# EAGLE design AQS (EAGLE 9.6.2)

## Sheet 1 of 2
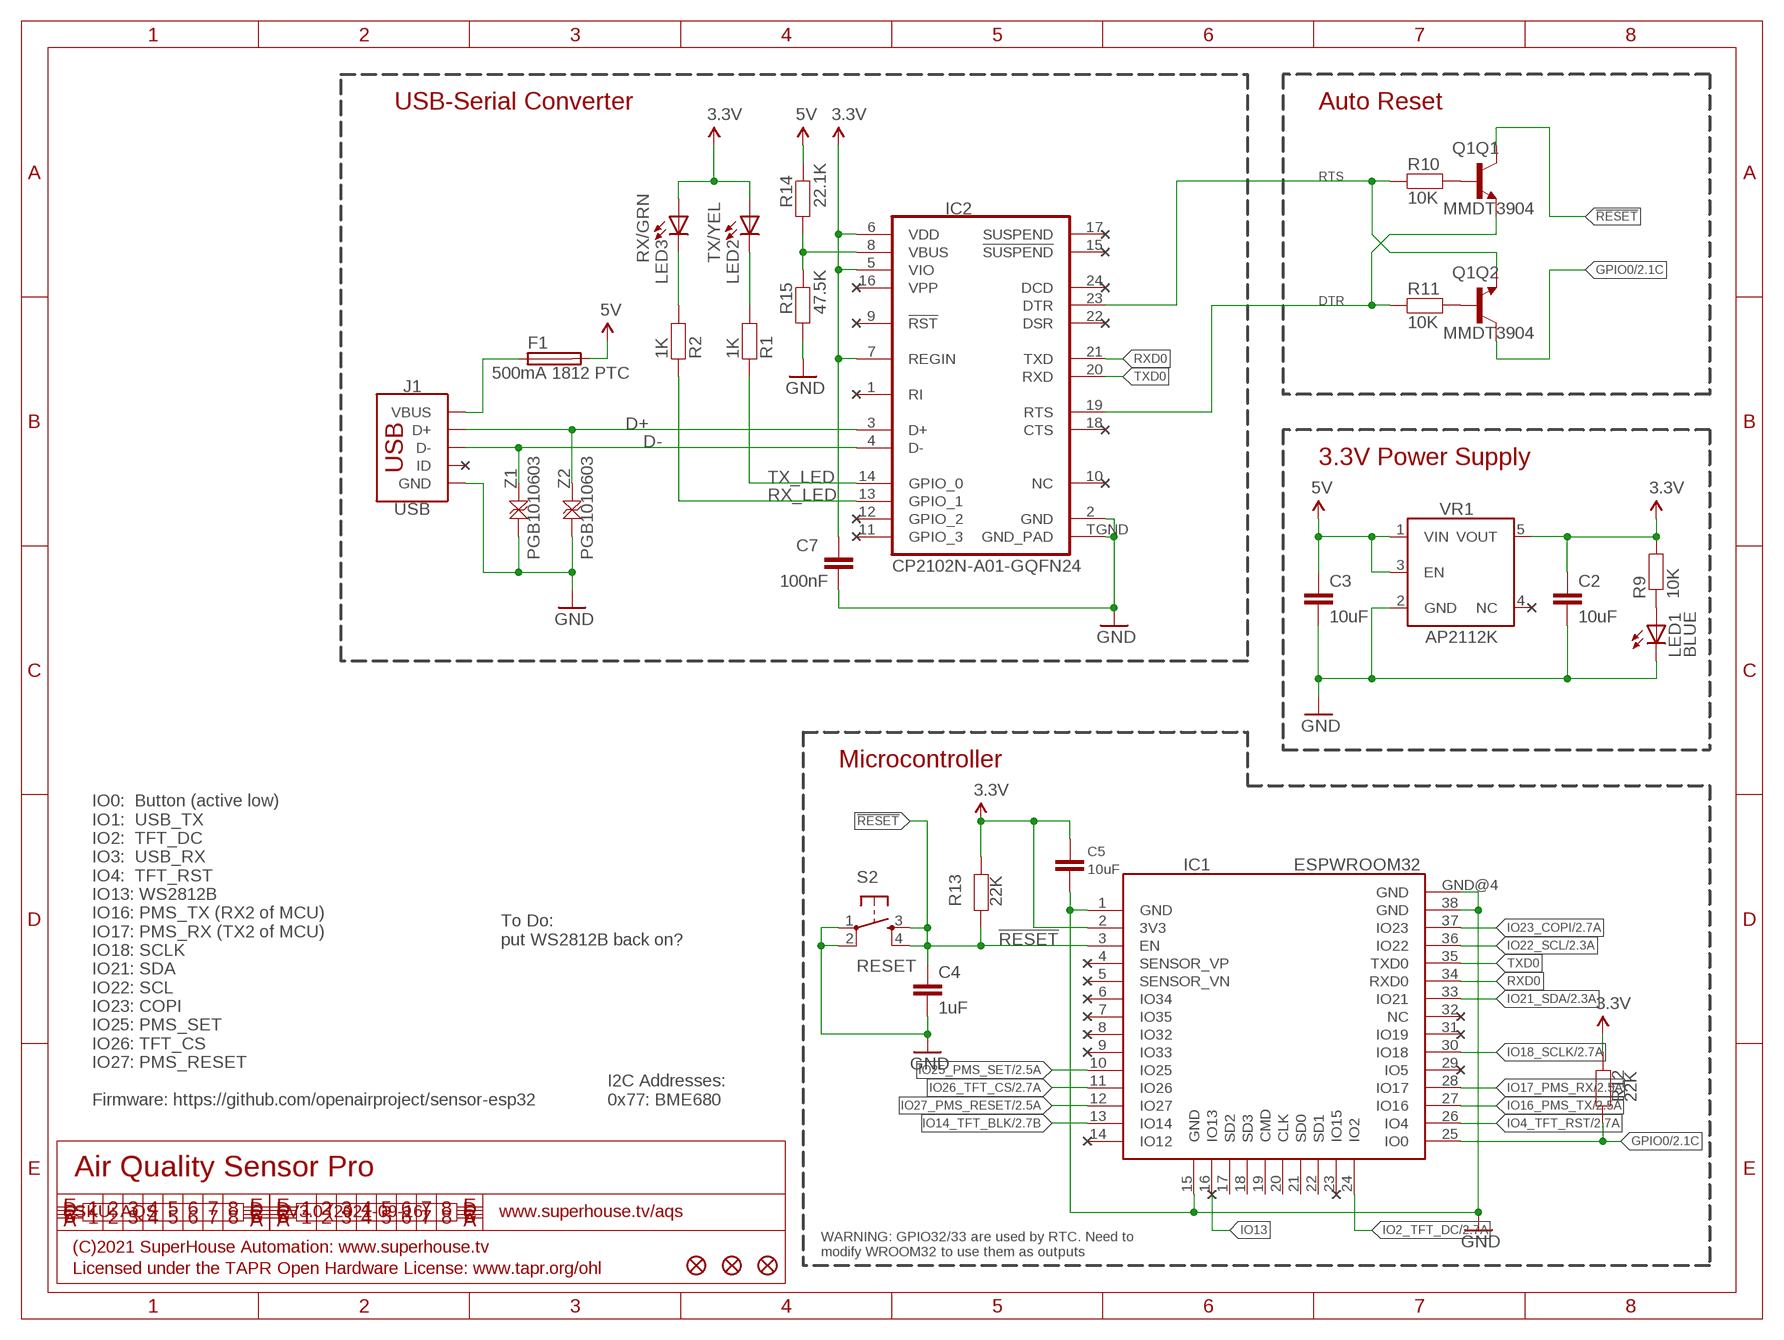
[diagram p0: schematic, sheet 1]

### Parts
C2  10uF  CAP0805  [C0805]
C3  10uF  CAP0805  [C0805]
C4  1uF  CAP0603  [C0603]
C5  10uF  CAP0805  [C0805]
C7  100nF  CAP0603  [C0603]
F1  500mA 1812 PTC  PTC-1206  [1206]
IC1  ESPWROOM32  [ESPWROOM32]
IC2  CP2102N-A01-GQFN24  CP2104  [QFN-24]
J1  USB  USB-B-5P-VERT  [USB-MICROB-VERT]
LED1  BLUE  LED0603  [LED-0603]
LED2  TX/YEL  LED0603  [LED-0603]
LED3  RX/GRN  LED0603  [LED-0603]
Q1  MMDT3904  TRANS_NPN_DUAL-MMDT3904  [SOT-363]
R1  1K  RESISTOR0603  [R0603]
R2  1K  RESISTOR0603  [R0603]
R9  10K  RESISTOR0603  [R0603]
R10  10K  RESISTOR0603  [R0603]
R11  10K  RESISTOR0603  [R0603]
R12  22K  RESISTOR0603  [R0603]
R13  22K  RESISTOR0603  [R0603]
R14  22.1K  RESISTOR0603  [R0603]
R15  47.5K  RESISTOR0603  [R0603]
S2  RESET  TAC_SWITCH-PTH-4.5  [TACTILE-PTH-4.5MM]
U$23  FIDUCIAL1X2  [FIDUCIAL-1X2]
U$24  FIDUCIAL1X2  [FIDUCIAL-1X2]
U$25  FIDUCIAL1X2  [FIDUCIAL-1X2]
VR1  AP2112KSOT25  [SOT23-5]
Z1  PGB1010603  TVS0603  [TVS0603]
Z2  PGB1010603  TVS0603  [TVS0603]

### Nets
3.3V: C2.1 C5.1 C7.1 IC1.2(3V3) IC2.5(VIO) IC2.6(VDD) IC2.7(REGIN) LED2.A LED3.A R9.2 R12.1 R13.1 VR1.5(VOUT) ; also sheet 2
5V: C3.1 F1.2 R14.2 VR1.1(VIN) VR1.3(EN) ; also sheet 2
!RESET: C4.1 IC1.3(EN) Q1.3(Q1:C) R13.2 S2.3 S2.4
D+: IC2.3(D+) J1.3(D+) Z2.2
D-: IC2.4(D-) J1.2(D-) Z1.2
DTR: IC2.23(DTR) Q1.1(Q2:E) R10.1
GND: C2.2 C3.2 C4.2 C5.2 C7.2 IC1.1(GND) IC1.15(GND) IC1.38(GND) IC1.GND@4(GND) IC2.2(GND) IC2.TGND(GND_PAD) J1.5(GND) J1.POST1(GND) J1.POST2(GND) LED1.C R15.1 S2.1 S2.2 VR1.2(GND) Z1.1 Z2.1 ; also sheet 2
GPIO0: IC1.25(IO0) Q1.6(Q2:C) R12.2 ; also sheet 2
IO2_TFT_DC: IC1.24(IO2) ; also sheet 2
IO4_TFT_RST: IC1.26(IO4) ; also sheet 2
IO13: IC1.16(IO13)
IO14_TFT_BLK: IC1.13(IO14) ; also sheet 2
IO16_PMS_TX: IC1.27(IO16) ; also sheet 2
IO17_PMS_RX: IC1.28(IO17) ; also sheet 2
IO18_SCLK: IC1.30(IO18) ; also sheet 2
IO21_SDA: IC1.33(IO21) ; also sheet 2
IO22_SCL: IC1.36(IO22) ; also sheet 2
IO23_COPI: IC1.37(IO23) ; also sheet 2
IO25_PMS_SET: IC1.10(IO25) ; also sheet 2
IO26_TFT_CS: IC1.11(IO26) ; also sheet 2
IO27_PMS_RESET: IC1.12(IO27) ; also sheet 2
N$1: LED1.A R9.1
N$2: LED3.C R2.2
N$3: F1.1 J1.1(VBUS)
N$7: Q1.5(Q1:B) R10.2
N$8: Q1.2(Q2:B) R11.2
N$13: LED2.C R1.2
N$39: IC2.8(VBUS) R14.1 R15.2
RTS: IC2.19(RTS) Q1.4(Q1:E) R11.1
RX_LED: IC2.13(GPIO_1) R2.1
RXD0: IC1.34(RXD0) IC2.21(TXD)
TX_LED: IC2.14(GPIO_0) R1.1
TXD0: IC1.35(TXD0) IC2.20(RXD)
Unconnected: IC1.4(SENSOR_VP) IC1.5(SENSOR_VN) IC1.6(IO34) IC1.7(IO35) IC1.8(IO32) IC1.9(IO33) IC1.14(IO12) IC1.17(SD2) IC1.18(SD3) IC1.19(CMD) IC1.20(CLK) IC1.21(SD0) IC1.22(SD1) IC1.23(IO15) IC1.29(IO5) IC1.31(IO19) IC1.32(NC) IC2.1(RI) IC2.9(!RST) IC2.10(NC) IC2.11(GPIO_3) IC2.12(GPIO_2) IC2.15(!SUSPEND) IC2.16(VPP) IC2.17(SUSPEND) IC2.18(CTS) IC2.22(DSR) IC2.24(DCD) J1.4(ID) VR1.4(NC)

### Notes on the sheet
- USB-Serial Converter | Auto Reset
- 3.3V Power Supply
- Microcontroller
- To Do:
  put WS2812B back on?
- IO0:  Button (active low)
  IO1:  USB_TX
  IO2:  TFT_DC
  IO3:  USB_RX
  IO4:  TFT_RST
  IO13: WS2812B
  IO16: PMS_TX (RX2 of MCU)
  IO17: PMS_RX (TX2 of MCU)
  IO18: SCLK
  IO21: SDA
  IO22: SCL
  IO23: COPI
  IO25: PMS_SET
  IO26: TFT_CS
  IO27: PMS_RESET
  
  Firmware: https://github.com/openairproject/sensor-esp32
- I2C Addresses:
  0x77: BME680
- Air Quality Sensor Pro
- SKU: AQS | V3.0 (2021-09-16) | www.superhouse.tv/aqs
- (C)2021 SuperHouse Automation: www.superhouse.tv
- WARNING: GPIO32/33 are used by RTC. Need to
  modify WROOM32 to use them as outputs
- Licensed under the TAPR Open Hardware License: www.tapr.org/ohl

## Sheet 2 of 2
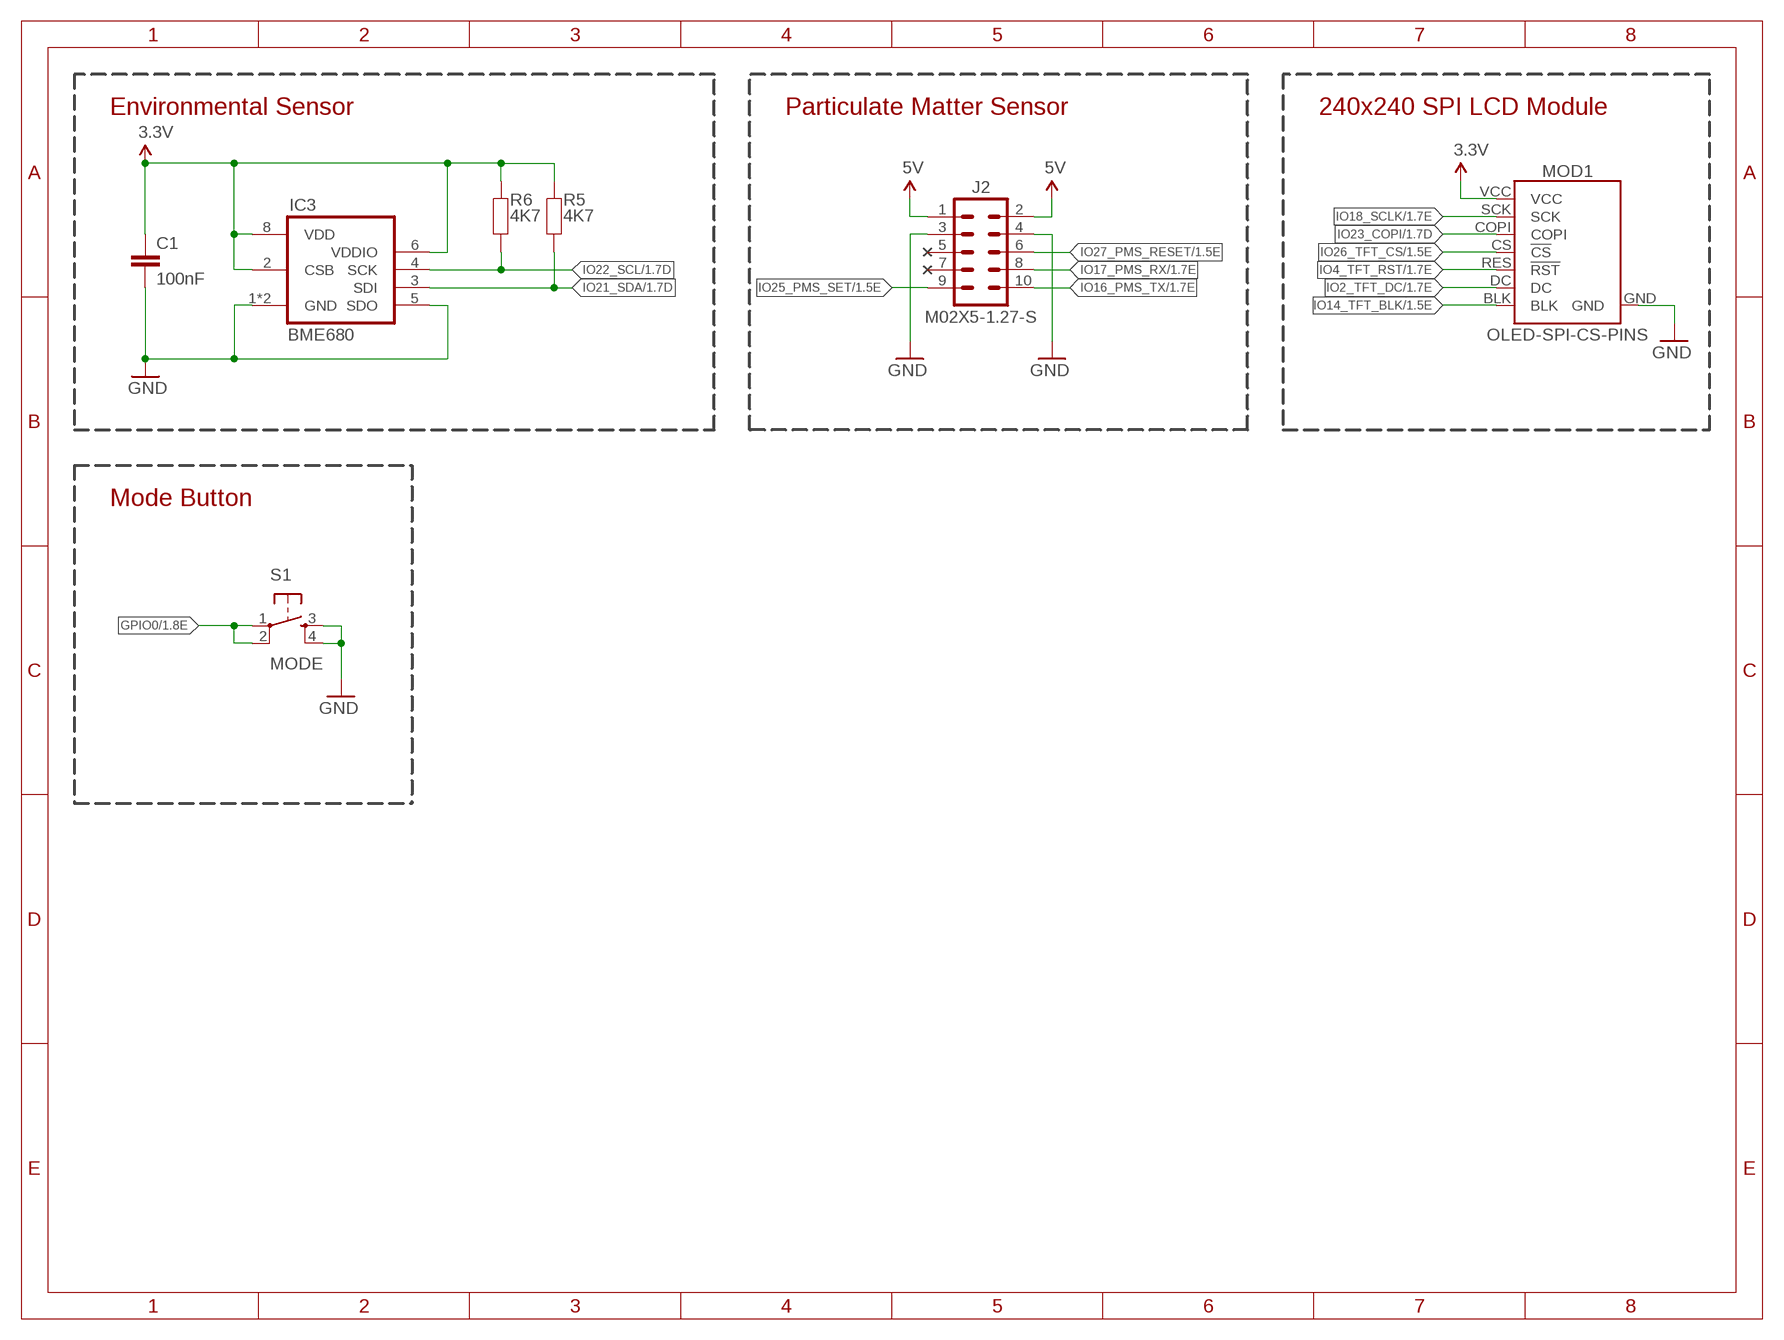
[diagram p1: schematic, sheet 2]

### Parts
C1  100nF  CAP0603  [C0603]
IC3  BME680  [BME680]
J2  M02X5-1.27-S  [2X05-1.27-S]
MOD1  OLED-SPI-CS-PINS  [OLED-240X240-1.54]
R5  4K7  RESISTOR0603  [R0603]
R6  4K7  RESISTOR0603  [R0603]
S1  MODE  TAC_SWITCH-PTH-4.5  [TACTILE-PTH-4.5MM]

### Nets
3.3V: C1.1 IC3.2(CSB) IC3.6(VDDIO) IC3.8(VDD) MOD1.VCC R5.2 R6.2 ; also sheet 1
5V: J2.1 J2.2 ; also sheet 1
GND: C1.2 IC3.1(GND) IC3.5(SDO) IC3.7(GND) J2.3 J2.4 MOD1.GND S1.3 S1.4 ; also sheet 1
GPIO0: S1.1 S1.2 ; also sheet 1
IO2_TFT_DC: MOD1.DC ; also sheet 1
IO4_TFT_RST: MOD1.RES(!RST) ; also sheet 1
IO14_TFT_BLK: MOD1.BLK ; also sheet 1
IO16_PMS_TX: J2.10 ; also sheet 1
IO17_PMS_RX: J2.8 ; also sheet 1
IO18_SCLK: MOD1.SCK ; also sheet 1
IO21_SDA: IC3.3(SDI) R5.1 ; also sheet 1
IO22_SCL: IC3.4(SCK) R6.1 ; also sheet 1
IO23_COPI: MOD1.COPI ; also sheet 1
IO25_PMS_SET: J2.9 ; also sheet 1
IO26_TFT_CS: MOD1.CS(!CS) ; also sheet 1
IO27_PMS_RESET: J2.6 ; also sheet 1
Unconnected: J2.5 J2.7

### Notes on the sheet
- Environmental Sensor | Particulate Matter Sensor | 240x240 SPI LCD Module
- Mode Button

## Library data of the parts
C1-C5 C7 = SuperHouse-DiscreteSemi:CAP: Capacitor Standard ceramic capacitor
F1 = SuperHouse-Fuses:PTC: Resettable polyfuses
IC1 = SuperHouse-MCUs:ESPWROOM32: Espressif WROOM32 ESP32 module
IC2 = SuperHouse-ICs:CP2104: CP2104 / CP2102N-A01-GQFN24 CP2104 USB to serial converter. The CP2104 is not recommended for new designs: replace with CP2102N-A01-GQFN24.
IC3 = SuperHouse-Sensors:BME680: BME680 humdity, pressure, temperature, and gas sensor
J1 = SuperHouse-Connectors:USB-B-5P: USB connector with 5 pins
J2 = SuperHouse-Connectors:M02X5: M10 header in 2x5 format
LED1-LED3 = SuperHouse-LEDs:LED: LEDs in various sizes including 5mm and 3mm PTH, and 0402, 0603, 0805, etc SMT
MOD1 = SuperHouse-Displays:OLED-SPI-CS
Q1 = SuperHouse-DiscreteSemi:TRANS_NPN_DUAL: MMDT3904 Dual 3904 NPN transistors. Datasheet <http://www.onsemi.com/pub_link/Collateral/MBT3904DW1T1-D.PDF>; PROD_ID: TRANS-13337
R1 R2 R5 R6 R9-R15 = SuperHouse-DiscreteSemi:RESISTOR: Resistor Standard resistors.
S1 S2 = SuperHouse-Switches:TAC_SWITCH: Momentary Switch Tactile switch, normally-open.
U$23-U$25 = SuperHouse-Symbols:FIDUCIAL: Fiducial Alignment Points Various fiducial points for machine vision alignment.
VR1 = SuperHouse-Regulators:AP2112K: AP2112K LDO linear voltage regulator
Z1 Z2 = SuperHouse-DiscreteSemi:TVS: TVS voltage protection Zener

## Net classes
0 default: width 0.203 mm, drill 0.356 mm, clearance 0.152 mm
1 power: width 0.203 mm, clearance 0.152 mm

## Board
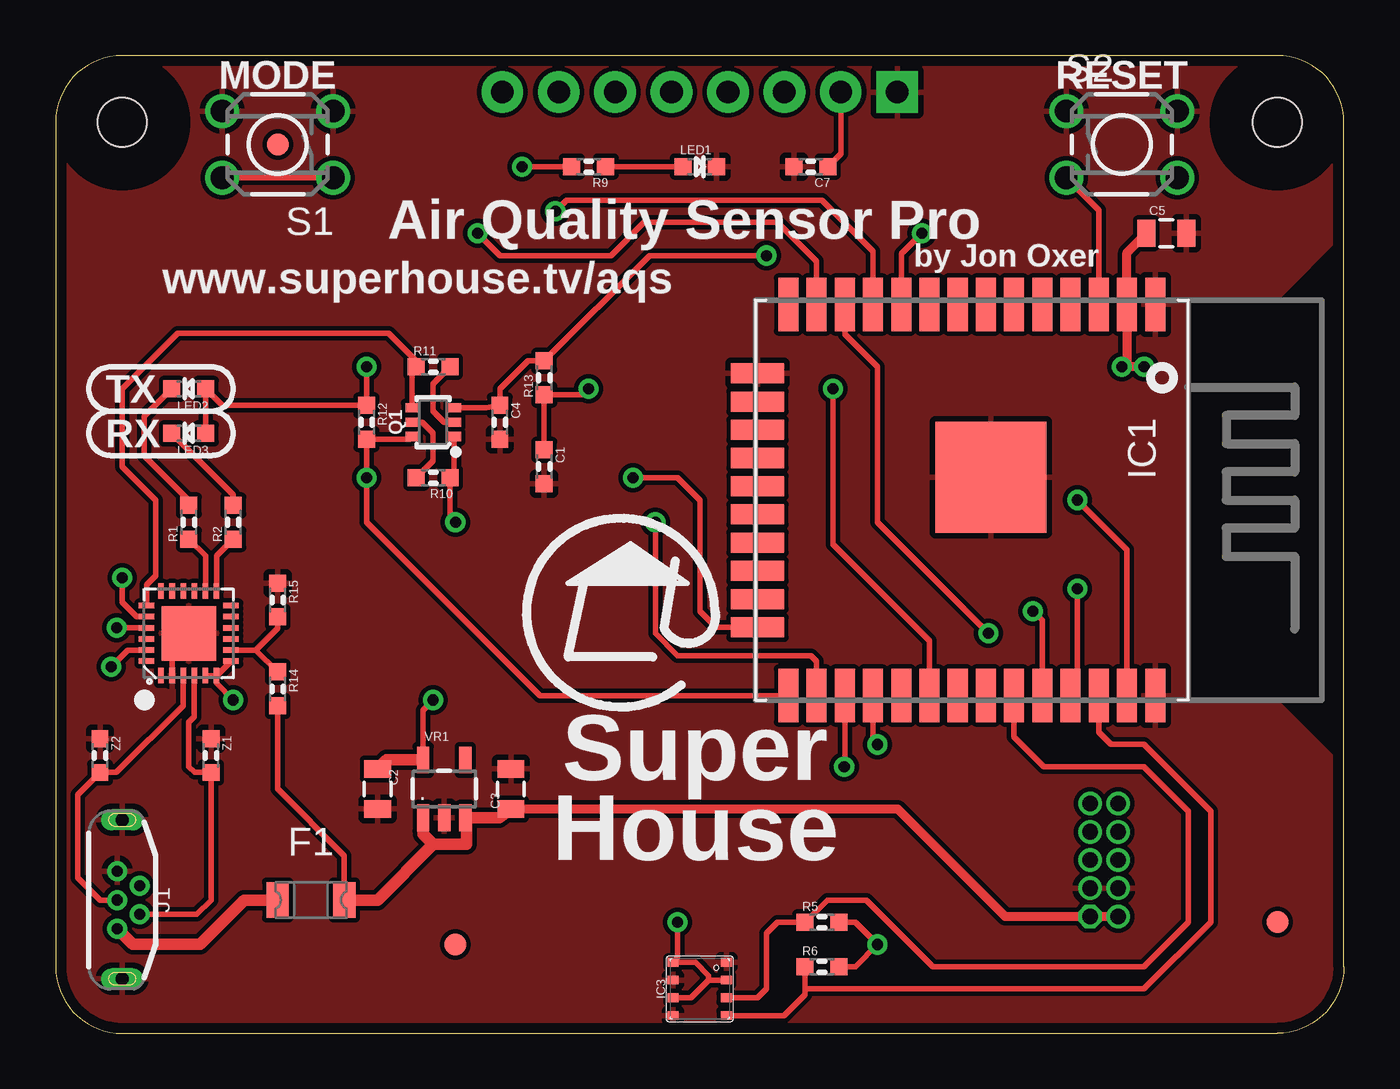
[diagram p2: board, top side]
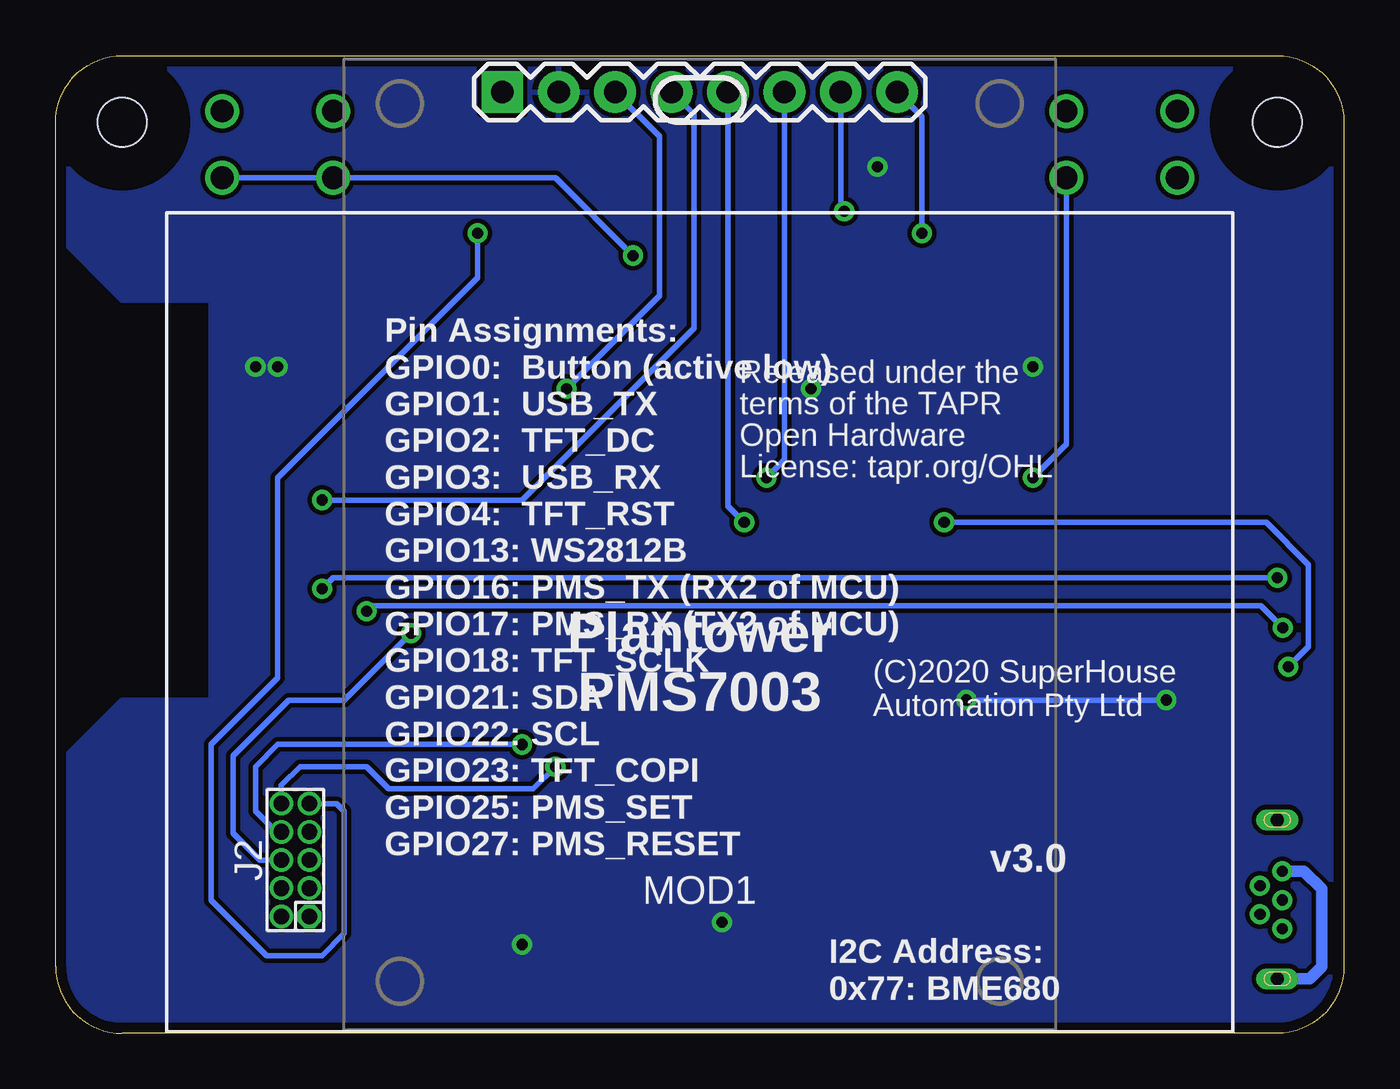
[diagram p3: board, bottom side, seen from below]

Size 58 x 44 mm. Coordinates in mm from the lower left corner, seen from the top.
Outline: 0,41 0,3 arc90 3,0 55,0 arc90 58,3 58,41 arc90 55,44 3,44 arc90 0,41
Copper layers (1*16): Top 0.035mm / dielectric 1.5mm / Bottom 0.035mm
Design rules "SuperHouse-Design-Rules *": minimum track width 10mil, minimum drill 24mil, track to track 8mil, track to pad 8mil, pad to pad 8mil, via to via 8mil, smd to smd 6mil, copper to edge 18mil, drill to drill 8mil, minimum pad ring 7mil, minimum via ring 8mil, stop-mask expansion 4mil, vias tented up to drill 0.5mm, thermal gap 10mil
Holes 2.2 mm at 3,41 55,41
tRestrict: area 0,38 to 6,44; area 52,38 to 58,44
bRestrict: area 0,38 to 6,44; area 52,38 to 58,44

### Footprints (pad centres in the part's own frame; a part is rotated, then mirrored left to right if it is on the bottom)
C0603 = smd 0.762 x 0.762: 1 -0.762,0; 2 0.762,0
C0805 = smd 0.8 x 1.2: 1 -0.9,0; 2 0.9,0
1206 = smd 1 x 1.6: 1 -1.5,0; 2 1.5,0
ESPWROOM32 = smd 2.4 x 0.9: 1 -8.8,-1.5; 2 -8.8,-2.77; 3 -8.8,-4.04; 4 -8.8,-5.31; 5 -8.8,-6.58; 6 -8.8,-7.85; 7 -8.8,-9.12; 8 -8.8,-10.39; 9 -8.8,-11.66; 10 -8.8,-12.93; 11 -8.8,-14.2; 12 -8.8,-15.47; 13 -8.8,-16.74; 14 -8.8,-18.01; 25 8.8,-18.01; 26 8.8,-16.74; 27 8.8,-15.47; 28 8.8,-14.2; 29 8.8,-12.93; 30 8.8,-11.66; 31 8.8,-10.39; 32 8.8,-9.12; 33 8.8,-7.85; 34 8.8,-6.58; 35 8.8,-5.31; 36 8.8,-4.04; 37 8.8,-2.77; 38 8.8,-1.5 | smd 0.9 x 2.4: 15 -5.7,-19.4; 16 -4.43,-19.4; 17 -3.16,-19.4; 18 -1.89,-19.4; 19 -0.62,-19.4; 20 0.65,-19.4; 21 1.92,-19.4; 22 3.19,-19.4; 23 4.46,-19.4; 24 5.73,-19.4 | smd 5 x 5: GND@4 -1.03,-8.89
QFN-24 = smd 0.25 x 0.7: 1 -1.25,-1.9; 2 -0.75,-1.9; 3 -0.25,-1.9; 4 0.25,-1.9; 5 0.75,-1.9; 6 1.25,-1.9; 13 1.25,1.9; 14 0.75,1.9; 15 0.25,1.9; 16 -0.25,1.9; 17 -0.75,1.9; 18 -1.25,1.9 | smd 0.7 x 0.25: 7 1.9,-1.25; 8 1.9,-0.75; 9 1.9,-0.25; 10 1.9,0.25; 11 1.9,0.75; 12 1.9,1.25; 19 -1.9,1.25; 20 -1.9,0.75; 21 -1.9,0.25; 22 -1.9,-0.25; 23 -1.9,-0.75; 24 -1.9,-1.25 | smd 2.45 x 2.45: TGND 0,0
BME680 = smd 0.4 x 0.5: 1 1.2,-1.2; 2 0.4,-1.2; 3 -0.4,-1.2; 4 -1.2,-1.2; 5 -1.2,1.2; 6 -0.4,1.2; 7 0.4,1.2; 8 1.2,1.2
USB-MICROB-VERT = drill 0.5 pad 0.9: 1 -1.3,0.22; 2 -0.65,-0.78; 3 0,0.22; 4 0.65,-0.78; 5 1.3,0.22 | drill 0.6 pad 0.8 long: POST1 -3.545,0; POST2 3.605,0
2X05-1.27-S = drill 0.7 pad 1.016 octagon: 1 -2.54,-0.635 | drill 0.7 pad 1.016: 2 -2.54,0.635; 3 -1.27,-0.635; 4 -1.27,0.635; 5 0,-0.635; 6 0,0.635; 7 1.27,-0.635; 8 1.27,0.635; 9 2.54,-0.635; 10 2.54,0.635
LED-0603 = smd 0.762 x 0.762: A -0.762,0; C 0.762,0
OLED-240X240-1.54 = drill 1.016 pad 1.88: BLK 8.89,20.36; COPI -1.27,20.36; CS 6.35,20.36; DC 3.81,20.36; RES 1.27,20.36; SCK -3.81,20.36; VCC -6.35,20.36 | drill 1.016 pad 1.88 square: GND -8.89,20.36
SOT-363 = smd 0.42 x 0.6: 1 -0.65,-0.95; 2 0,-0.95; 3 0.65,-0.95; 4 0.65,0.95; 5 0,0.95; 6 -0.65,0.95
R0603 = smd 0.762 x 0.762: 1 -0.762,0; 2 0.762,0
TACTILE-PTH-4.5MM = drill 1.016: 1 -2.5,1.5; 2 2.5,1.5; 3 -2.5,-1.5; 4 2.5,-1.5
FIDUCIAL-1X2 = smd 1 x 1: 1 0,0
SOT23-5 = smd 0.55 x 1.2: 1 -0.95,-1.3; 2 0,-1.3; 3 0.95,-1.3; 4 0.95,1.3; 5 -0.95,1.3
TVS0603 = smd 0.762 x 0.762: 1 -0.762,0; 2 0.762,0

### Placement (x,y rotation side)
C1  22,25.5 270 top
C2  14.5,11 270 top
C3  20.5,11 90 top
C4  20,27.5 270 top
C5  50,36 0 top
C7  34,39 180 top
F1  11.5,6 0 top
IC1  51,24 270 top
IC2  6,18 0 top
IC3  29,2 90 top
J1  3,6 90 top
J2  47.2,7.8 90 bottom
LED1  29,39 0 top
LED2  6,29 180 top
LED3  6,27 180 top
MOD1  29,22 0 bottom
Q1  17,27.5 90 top
R1  6,23 90 top
R2  8,23 90 top
R5  34.5,5 0 top
R6  34.5,3 0 top
R9  24,39 180 top
R10  17,25 180 top
R11  17,30 0 top
R12  14,27.5 270 top
R13  22,29.5 90 top
R14  10,15.5 270 top
R15  10,19.5 270 top
S1  10,40 180 top
S2  48,40 0 top
U$23  10,40 0 top
U$24  55,5 0 top
U$25  18,4 0 top
VR1  17.5,11 0 top
Z1  7,12.5 270 top
Z2  2,12.5 270 top

### Tracks (layer width: path | path; a pad name or v marks a point on that pad's centre or on a via)
3.3V  (via drill 0.5)
  Top 0.254: IC3.6 28.6,1.6 29.4,2.4 | IC3.2 29.4,2.4 | 29.4,2.4 29.4,2.6 28.8,3.2 IC3.8 28,3.4 v28,5 | R6.2 36,3 v37,4 36,5 R5.2 | LED3.A LED2.A 7.5,28.26 R12.1 v14,30 | IC2.5 IC2.6 | IC2.6 IC2.7 | IC2.6 7.25,15.75 v8,15 | v17,15 16.55,14.55 VR1.5 | C1.1 R13.1 23.74,28.74 v24,29 | v21,39 R9.2 | MOD1.VCC 35.35,39.59 C7.1
  Top 0.406: C5.1 48.23,35.13 IC1.2 48.23,30.23 v48,30 v49,30
  Top 0.508: C2.1 14.9,12.3 VR1.5
  Bottom 0.254: v8,15 v17,15
  pour Bottom: 0,41 arc-90 3,44 55,44 arc-90 58,41 58,36 55,33 51,33 51,15 55,15 58,12 58,3 arc-90 55,0 50,0 3,0 arc-90 0,3
5V
  Top 0.254: R14.2 10,11 13,8 F1.2
  Top 0.406: C3.1 37.9,10.1 42.74,5.26 J2.1 J2.2
  Top 0.508: 17,8.5 18.5,8.5 18.5,9.65 VR1.3 19.96,9.7 C3.1 | F1.2 14.5,6 17,8.5 | 17,8.5 16.55,8.95 VR1.1
!RESET  (via drill 0.5)
  Top 0.254: Q1.3 19.39,28.15 C4.1 20,29 21.26,30.26 R13.2 26.74,35 v32,35 | IC1.3 46.96,37.04 S2.3
  Bottom 0.254: v32,35 35.5,38.5 S2.3 S2.4
D+
  Top 0.254: IC2.3 5.75,14.75 2.74,11.74 Z2.2 1,10.74 1,7 2,6 J1.3
D-
  Top 0.254: IC2.4 6.25,14.25 6,14 6,12 6.26,11.74 Z1.2 7,6 6.35,5.35 J1.2
DTR  (via drill 0.5)
  Top 0.254: Q1.1 17.95,25.19 17.88,25.12 R10.1 17.76,23.24 v18,23 | IC2.23 3.25,17.25 v2.5,16.5
  Bottom 0.254: v2.5,16.5 1.6,17.4 1.6,21.1 3.5,23 v18,23
GND
  Top 0.254: IC2.2 5.25,17.25 IC2.TGND
  Bottom 0.508: J1.POST1 1.54,2.45 1,3 1,6.5 1.8,7.3 J1.5
  pour Top: 0,3 0,41 arc-90 3,44 55,44 arc-90 58,41 58,36 55,33 51,33 51,15 55,15 58,12 58,3 arc-90 55,0 50,0 3,0 arc-90
GPIO0  (via drill 0.5)
  Top 0.254: S1.1 S1.2 | Q1.6 15.94,26.74 R12.2 v14,25 14,23 21.8,15.2 IC1.25
  Bottom 0.254: v14,25 12.5,26.5 S1.1
IO2_TFT_DC  (via drill 0.5)
  Top 0.254: v26,25 28,25 29,24 29,19 29.73,18.27 IC1.24
  Bottom 0.254: MOD1.DC 25.19,25.81 v26,25
IO4_TFT_RST  (via drill 0.5)
  Top 0.254: v27,23 27,18 28,17 34,17 34.26,16.74 IC1.26
  Bottom 0.254: MOD1.RES 27.73,23.73 v27,23
IO14_TFT_BLK  (via drill 0.5)
  Top 0.254: IC1.13 34.26,34.74 32.5,36.5 26.5,36.5 25,35 20,35 v19,36
  Bottom 0.254: v19,36 19,41.25 MOD1.BLK
IO16_PMS_TX  (via drill 0.5)
  Top 0.254: v35.5,12 35.53,12.03 IC1.27
  Bottom 0.254: J2.10 47.84,11.16 47,12 44,12 43,11 36.5,11 v35.5,12
IO17_PMS_RX  (via drill 0.5)
  Top 0.254: v37,13 36.8,13.2 IC1.28
  Bottom 0.254: J2.8 48.07,9.07 49,10 49,12 48,13 v37,13
IO18_SCLK  (via drill 0.5)
  Top 0.254: IC1.30 39.34,17.66 35,22 v35,29
  Bottom 0.254: v35,29 30.81,33.19 30.81,40.36 MOD1.SCK
IO21_SDA
  Top 0.254: IC3.3 31.6,1.6 32,2 32,4.5 32.5,5 R5.1 34.74,6 36.5,6 39.5,3 49,3 51,5 51,10 49,12 44.5,12 43.15,13.35 IC1.33
IO22_SCL
  Top 0.254: 33.74,2 33.74,1.74 32.8,0.8 IC3.4 | 33.74,2 R6.1 | 33.74,2 49,2 52,5 52,10 49,13 47.5,13 46.96,13.54 IC1.36
IO23_COPI  (via drill 0.5)
  Top 0.254: IC1.37 48.23,21.77 v46,24
  Bottom 0.254: MOD1.COPI 29.27,41.36 29.27,31.73 37,24 v46,24
IO25_PMS_SET  (via drill 0.5)
  Top 0.254: IC1.10 38.07,35.07 v39,36
  Bottom 0.254: v39,36 39,34 48,25 48,16 51,13 51,6 48.5,3.5 46,3.5 45,4.5 45,10 45.34,10.34 J2.9
IO26_TFT_CS  (via drill 0.5)
  Top 0.254: IC1.11 36.8,35.2 34.5,37.5 23,37.5 v22.5,37
  Bottom 0.254: v22.5,37 22.65,37.15 MOD1.CS
IO27_PMS_RESET  (via drill 0.5)
  Top 0.254: IC1.12 35.53,31.47 37,30 37,23 v42,18
  Bottom 0.254: v42,18 45,15 47.5,15 50,12.5 50,9 48.8,7.8 J2.6
N$1
  Top 0.254: R9.1 LED1.A
N$2
  Top 0.254: R2.2 8,24.24 LED3.C
N$3
  Top 0.254: 10,5.55 F1.1
  Top 0.508: J1.1 3.48,4 6.5,4 8.5,6 F1.1
N$7
  Top 0.254: Q1.5 16.5,27.5 17,27 17,25.76 R10.2
N$8
  Top 0.254: Q1.2 17.5,27.5 17,28 17,29.24 R11.2
N$13
  Top 0.254: R1.2 6,24 4,26 4,27.76 LED2.C
N$39
  Top 0.254: IC2.8 9.01,17.25 | 9.01,17.25 R14.1 | R15.2 10,18.24 9.01,17.25
RTS
  Top 0.254: Q1.4 16.05,29.81 R11.1 16.24,30.26 15,31.5 5.5,31.5 3,29 3,25.5 4.5,24 4.5,20.59 4.1,20.19 IC2.19
RX_LED
  Top 0.254: IC2.13 7.25,21.49 R2.1
RXD0  (via drill 0.5)
  Top 0.254: IC2.21 v2.75,18.25 | v44,19 44.42,18.58 IC1.34
  Bottom 0.254: v44,19 43.75,19.25 3.75,19.25 v2.75,18.25
TX_LED
  Top 0.254: IC2.14 6.75,21.49 R1.1
TXD0  (via drill 0.5)
  Top 0.254: IC2.20 3.66,18.75 3,19.41 v3,20.5 | v46,20 46,15.51 IC1.35
  Bottom 0.254: v3,20.5 45.5,20.5 v46,20

### Text on the board
tPlace: MODE | RESET | Air Quality Sensor Pro | by Jon Oxer | www.superhouse.tv/aqs | TX | RX | Super / House
bPlace: Released under the / terms of the TAPR / Open Hardware / License: tapr.org/OHL | (C)2020 SuperHouse / Automation Pty Ltd | Plantower / PMS7003 | Pin Assignments: / GPIO0: Button (active low) / GPIO1: USB_TX / GPIO2: TFT_DC / GPIO3: USB_RX / GPIO4: TFT_RST / GPIO13: WS2812B / GPIO16: PMS_TX (RX2 of MCU) / GPIO17: PMS_RX (TX2 of MCU) / GPIO18: TFT_SCLK / GPIO21: SDA / GPIO22: SCL / GPIO23: TFT_COPI / GPIO25: PMS_SET / GPIO27: PMS_RESET | v3.0 | I2C Address: / 0x77: BME680